# Altium schematic sheet ethernet.SchDoc
size A4
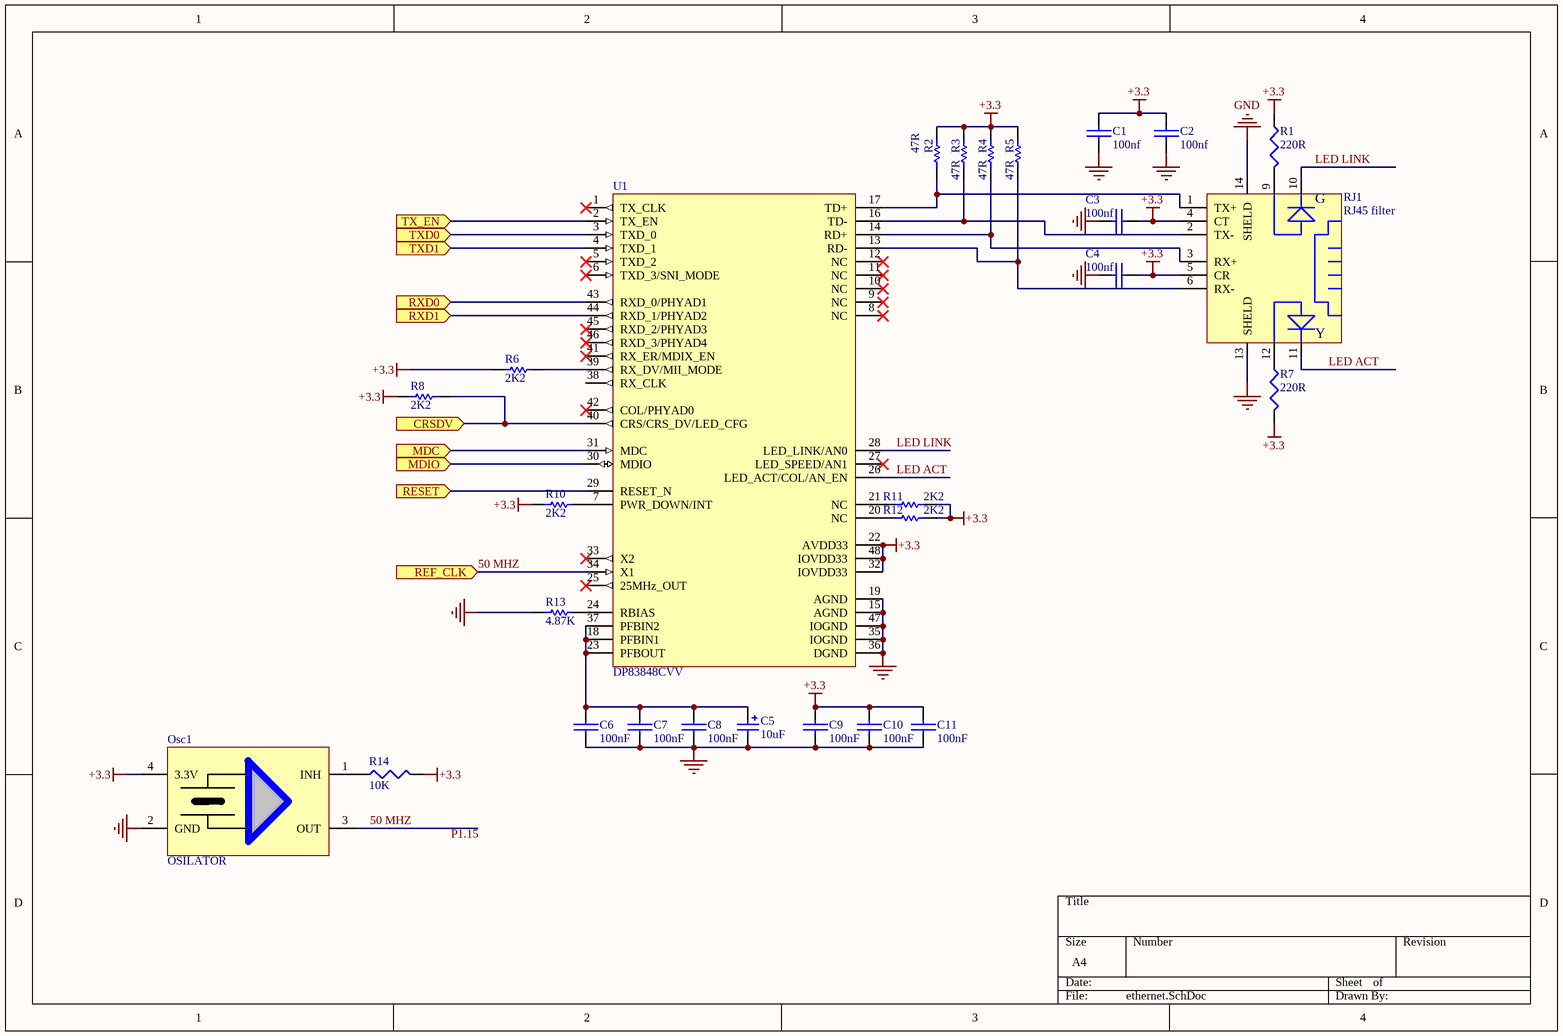
[diagram p0: ethernet.SchDoc]

## Parts
C1  100nf  [1206]
C2  100nf  [1206]
C3  100nf  [1206]
C4  100nf  [1206]
C5  10uF  [cap10]
C6  100nF  [0805]
C7  100nF  [0805]
C8  100nF  [0805]
C9  100nF  [0805]
C10  100nF  [0805]
C11  100nF  [0805]
Osc1  OSILATOR  [XTAL_5X7]
R1  220R  [1206]
R2  47R  [1206]
R3  47R  [1206]
R4  47R  [1206]
R5  47R  [1206]
R6  2K2  [1206]
R7  220R  [1206]
R8  2K2  [1206]
R10  2K2  [1206]
R11  2K2  [1206]
R12  2K2  [1206]
R13  4.87K  [1206]
R14  10K  [1206]
RJ1  RJ45 filter  [RJ45LED]
U1  DP83848CVV  [TQFP48_M]

## Ports
CRSDV (in), MDC (in), MDIO (in), REF_CLK (in), RESET (in), RXD0 (in), RXD1 (in), TX_EN (in), TXD0 (in), TXD1 (in)

## Nets
+3.3: C1.2 C2.2 C3.2 C4.2 C9.1 C10.2 C11.2 Osc1.4(3.3V) R1.1 R2.2 R3.2 R4.2 R5.2 R6.1 R7.1 R8.1 R10.1 R11.2 R12.2 R14.2 RJ1.4(CT) RJ1.5(CR) U1.22(AVDD33) U1.32(IOVDD33) U1.48(IOVDD33)
GND: C1.1 C2.1 C3.1 C4.1 C5.2 C6.2 C7.1 C8.1 C9.2 C10.1 C11.1 Osc1.2(GND) R13.1 RJ1.13(SHELD) RJ1.14(SHELD) U1.15(AGND) U1.19(AGND) U1.35(IOGND) U1.36(DGND) U1.47(IOGND)
50 MHZ: Osc1.3(OUT) U1.34(X1) ; port REF_CLK
CRSDV: R8.2 U1.40(CRS/CRS_DV/LED_CFG) ; port CRSDV
LED ACT: RJ1.11(ledy-) U1.26(LED_ACT/COL/AN_EN)
LED LINK: RJ1.10(ledg-) U1.28(LED_LINK/AN0)
MDC: U1.31(MDC) ; port MDC
MDIO: U1.30(MDIO) ; port MDIO
RESET: U1.29(RESET_N) ; port RESET
RXD0: U1.43(RXD_0/PHYAD1) ; port RXD0
RXD1: U1.44(RXD_1/PHYAD2) ; port RXD1
TX_EN: U1.2(TX_EN) ; port TX_EN
TXD0: U1.3(TXD_0) ; port TXD0
TXD1: U1.4(TXD_1) ; port TXD1
NetC5_1: C5.1 C6.1 C7.2 C8.2 U1.18(PFBIN1) U1.23(PFBOUT) U1.37(PFBIN2)
NetOsc1_1: Osc1.1(INH) R14.1
NetR1_2: R1.2 RJ1.9(ledg+)
NetR2_1: R2.1 RJ1.1(TX+) U1.17(TD+)
NetR3_1: R3.1 RJ1.2(TX-) U1.16(TD-)
NetR4_1: R4.1 RJ1.3(RX+) U1.14(RD+)
NetR5_1: R5.1 RJ1.6(RX-) U1.13(RD-)
NetR6_2: R6.2 U1.39(RX_DV/MII_MODE)
NetR7_2: R7.2 RJ1.12(ledy+)
NetR10_2: R10.2 U1.7(PWR_DOWN/INT)
NetR11_1: R11.1 U1.21(NC)
NetR12_1: R12.1 U1.20(NC)
NetR13_2: R13.2 U1.24(RBIAS)

Not connected (* = marked no-connect by the designer): U1 1(TX_CLK)* 5(TXD_2)* 6(TXD_3/SNI_MODE)* 8(NC)* 9(NC)* 10(NC)* 11(NC)* 12(NC)* 25(25MHz_OUT)* 27(LED_SPEED/AN1)* 33(X2)* 38(RX_CLK) 41(RX_ER/MDIX_EN)* 42(COL/PHYAD0)* 45(RXD_2/PHYAD3)* 46(RXD_3/PHYAD4)*

## Notes on the sheet
- Labels drawn without touching a wire or pin: P1.15
- (in symbol RJ45_led_filter) G; Y

## Library data of the parts
C1-C4 = CAP
C5 = Cap Pol1: Polarized Capacitor (Radial); Published: 8-Jun-2000; Revision: July-2002: Re-released for DXP Platform.; Publisher: Altium Limited; Value: 10uF
C6-C11 = CAP: Capacitor
R1 R7 R14 = Res3: Resistor; Value: 1K; Published: 8-Jun-2000; LatestRevisionDate: 04-Mar-2005; LatestRevisionNote: PCB Footprint replaced.; PackageReference: J1-0603; Publisher: Altium Limited
R2-R6 R8 R10-R13 = Res1: Resistor; Value: 1K; Published: 8-Jun-2000; Revision: July-2002: Re-released for DXP Platform.; Publisher: Altium Limited
RJ1 = RJ45_led_filter